# Altium schematic sheet KX1_DB_ADC_2.SchDoc
size A
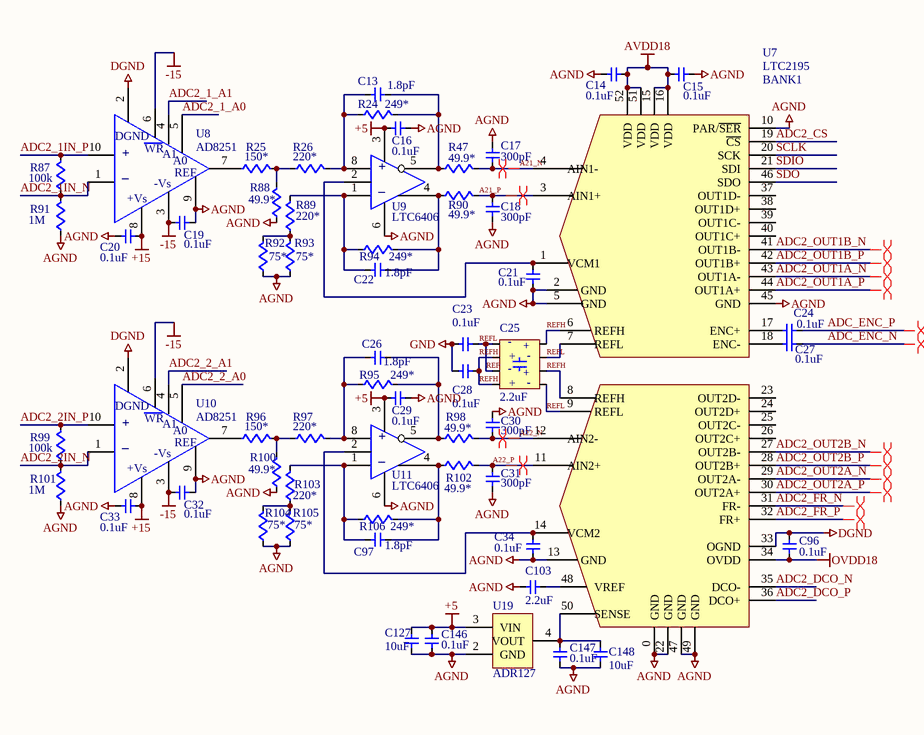
[diagram p0: KX1_DB_ADC_2.SchDoc]

## Parts
C13  1.8pF  [0603w]
C14  0.1uF  [0603w]
C15  0.1uF  [0603w]
C16  0.1uF  [0603w]
C17  300pF  [0603w]
C18  300pF  [0603w]
C19  0.1uF  [0603w]
C20  0.1uF  [0603w]
C21  0.1uF  [0603w]
C22  1.8pF  [0603w]
C23  0.1uF  [0603w]
C24  0.1uF  [1206]
C25  2.2uF  [1206CLL]
C26  1.8pF  [0603w]
C27  0.1uF  [1206]
C28  0.1uF  [0603w]
C29  0.1uF  [0603w]
C30  300pF  [0603w]
C31  300pF  [0603w]
C32  0.1uF  [0603w]
C33  0.1uF  [0603w]
C34  0.1uF  [0603w]
C96  0.1uF  [0603w]
C97  1.8pF  [0603w]
C103  2.2uF  [0603w]
C127  10uF  [0603w]
C146  0.1uF  [0603w]
C147  0.1uF  [0603w]
C148  10uF  [0603w]
R24  249*  [0603w]
R25  150*  [0603w]
R26  220*  [0603w]
R47  49.9*  [0603w]
R87  100k  [0603w]
R88  49.9*  [0603w]
R89  220*  [0603w]
R90  49.9*  [0603w]
R91  1M  [0603w]
R92  75*  [0603w]
R93  75*  [0603w]
R94  249*  [0603w]
R95  249*  [0603w]
R96  150*  [0603w]
R97  220*  [0603w]
R98  49.9*  [0603w]
R99  100k  [0603w]
R100  49.9*  [0603w]
R101  1M  [0603w]
R102  49.9*  [0603w]
R103  220*  [0603w]
R104  75*  [0603w]
R105  75*  [0603w]
R106  249*  [0603w]
U7  LTC2195  [UKG - QFN52]
U8  AD8251  [MSOP10sm]
U9  LTC6406  [MSOP08]
U10  AD8251  [MSOP10sm]
U11  LTC6406  [MSOP08]
U19  ADR127  [TSOT-6]

## Nets
+5: C16.1 C29.1 C127.1 C146.2 U9.3 U11.3 U19.3(VIN)
+15: C20.1 C33.1 U8.8 U10.8
-15: C19.1 C32.1 U8.3 U8.6 U10.3 U10.6
AGND: C14.2 C15.2 C16.2 C17.1 C18.2 C19.2 C20.2 C21.2 C29.2 C30.1 C31.2 C32.2 C33.2 C34.2 C103.2 C127.2 C146.1 C147.1 C148.2 R88.1 R91.1 R92.1 R93.1 R100.1 R101.1 R104.1 R105.1 U7.0(GND) U7.2(GND) U7.5(GND) U7.10(PAR/~{SER}) U7.13(GND) U7.22(GND) U7.45(GND) U7.47(GND) U7.49(GND) U8.9 U9.6 U10.9 U11.6 U19.2(GND)
AVDD18: C14.1 C15.1 U7.15(VDD) U7.16(VDD) U7.51(VDD) U7.52(VDD)
DGND: C96.1 U7.33(OGND) U8.2 U10.2
GND: C23.2 C28.2
OVDD18: C96.2 U7.34(OVDD)
A21_N: C17.2 R47.2 U7.4(AIN1-)
A21_P: C18.1 R90.2 U7.3(AIN1+)
A22_N: C30.2 R98.2 U7.12(AIN2-)
A22_P: C31.1 R102.2 U7.11(AIN2+)
ADC2_1_A0: U8.5
ADC2_1_A1: U8.4
ADC2_1IN_N: R87.1 R91.2 U8.1
ADC2_1IN_P: R87.2 U8.10
ADC2_2_A0: U10.5
ADC2_2_A1: U10.4
ADC2_2IN_N: R99.1 R101.2 U10.1
ADC2_2IN_P: R99.2 U10.10
ADC2_CS: U7.19(~{CS})
ADC2_DCO_N: U7.35(DCO-)
ADC2_DCO_P: U7.36(DCO+)
ADC2_FR_N: U7.31(FR-)
ADC2_FR_P: U7.32(FR+)
ADC2_OUT1A_N: U7.43(OUT1A-)
ADC2_OUT1A_P: U7.44(OUT1A+)
ADC2_OUT1B_N: U7.41(OUT1B-)
ADC2_OUT1B_P: U7.42(OUT1B+)
ADC2_OUT2A_N: U7.29(OUT2A-)
ADC2_OUT2A_P: U7.30(OUT2A+)
ADC2_OUT2B_N: U7.27(OUT2B-)
ADC2_OUT2B_P: U7.28(OUT2B+)
ADC_ENC_N: C27.2
ADC_ENC_P: C24.2
REFH: C25.2 C25.4 C25.6 C25.8 C28.1 U7.6(REFH) U7.8(REFH)
REFL: C23.1 C25.1 C25.3 C25.5 C25.7 U7.7(REFL) U7.9(REFL)
SCLK: U7.20(SCK)
SDIO: U7.21(SDI)
SDO: U7.46(SDO)
NetC13_1: C13.1 R24.1 R26.2 U9.8
NetC13_2: C13.2 R24.2 R47.1 U9.5
NetC21_1: C21.1 U7.1(VCM1) U9.2
NetC22_1: C22.1 R89.2 R94.1 U9.1
NetC22_2: C22.2 R90.1 R94.2 U9.4
NetC24_1: C24.1 U7.17(ENC+)
NetC26_1: C26.1 R95.1 R97.2 U11.8
NetC26_2: C26.2 R95.2 R98.1 U11.5
NetC27_1: C27.1 U7.18(ENC-)
NetC34_1: C34.1 U7.14(VCM2) U11.2
NetC97_1: C97.1 R103.2 R106.1 U11.1
NetC97_2: C97.2 R102.1 R106.2 U11.4
NetC103_1: C103.1 U7.48(VREF)
NetC147_2: C147.2 C148.1 U7.50(SENSE) U19.4(VOUT)
NetR25_1: R25.1 U8.7
NetR25_2: R25.2 R26.1 R88.2
NetR89_1: R89.1 R92.2 R93.2
NetR96_1: R96.1 U10.7
NetR96_2: R96.2 R97.1 R100.2
NetR103_1: R103.1 R104.2 R105.2

Not connected (* = marked no-connect by the designer): U7 23(OUT2D-) 24(OUT2D+) 25(OUT2C-) 26(OUT2C+) 37(OUT1D-) 38(OUT1D+) 39(OUT1C-) 40(OUT1C+); U19 1(NC) 5(NC) 6(NC)

## Layout directives
differential pair: A21_N, A21_P, A22_N, A22_P, ADC2_FR_N, ADC2_FR_P, ADC2_OUT1A_N, ADC2_OUT1A_P, ADC2_OUT1B_N, ADC2_OUT1B_P, ADC2_OUT2A_N, ADC2_OUT2A_P, ADC2_OUT2B_N, ADC2_OUT2B_P, ADC_ENC_N, ADC_ENC_P

## Notes on the sheet
- (near U7) BANK1
- (in symbol AD8139) +; _
- (in symbol AD8251) DGND; WR; +; A1; A0; _; REF; -Vs; +Vs
- (in symbol CAP_SM Interdigitated) +

## Library data of the parts
C13 C17 C18 C22 C26 C30 C31 C97 = CAP_SM_1: capacitor; Supplier 1: Digi-Key
  C13 C22 C26 C97: Supplier Part Number 1: 712-1328-1-ND
  C17 C18 C30 C31: Supplier Part Number 1: 490-1438-1-ND
C14 C15 C19-C21 C23 C28 C29 C32-C34 C96 C146 C147 = CAP_SM_1: capacitor; Manufacturer: Kemet; Manufacturer Part Number: C0603C104K3RACTU; Capacitance: 0.1µF; Temperature Coefficient: X7R; Tolerance: ±10%; Voltage - Rated: 25V; Applications: General Purpose; Category: Capacitors; ComponentLink1Description: http://www.kemet.com/datasheets&C0603C104K3RACTU; ComponentLink1URL: http://www.kemet.com/datasheets&C0603C104K3RACTU; Features: -; Lead Spacing: -; Lead Style: -; Mounting Type: Surface Mount, MLCC; Operating Temperature: -55°C ~ 125°C; Package / Case: 0603 (1608 Metric); Packaging: Cut Tape (CT); Pricing 1: 10=0.075, 100=0.027, 250=0.01952, 500=0.0144, 1000=0.00975 (USD); Ratings: -; RoHS: RoHS Compliant; Size / Dimension: 0.063" L x 0.031" W (1.60mm x 0.80mm); Stock 1: 1185883; Supplier 1: Digi-Key; Supplier Part Number 1: 399-1281-1-ND; Thickness: 0.034" (0.87mm)
C16 = CAP_SM_1: capacitor; Manufacturer: Kemet; Manufacturer Part Number: C0603C104K3RACTU; Capacitance: 0.1µF; Voltage - Rated: 25V; Tolerance: ±10%; Temperature Coefficient: X7R; Supplier 1: Digi-Key; Supplier Part Number 1: 399-1281-1-ND; RoHS: RoHS Compliant; Category: Capacitors; Stock 1: 1185883; Pricing 1: 10=0.075, 100=0.027, 250=0.01952, 500=0.0144, 1000=0.00975 (USD); Mounting Type: Surface Mount, MLCC; Operating Temperature: -55°C ~ 125°C; Applications: General Purpose; Ratings: -; Package / Case: 0603 (1608 Metric); Size / Dimension: 0.063" L x 0.031" W (1.60mm x 0.80mm); Height: -; Thickness: 0.034" (0.87mm); Lead Spacing: -; Features: -; Packaging: Cut Tape (CT); Lead Style: -; ComponentLink1URL: http://www.kemet.com/datasheets&C0603C104K3RACTU; ComponentLink1Description: http://www.kemet.com/datasheets&C0603C104K3RACTU
C24 C27 = CAP_SM_1: capacitor; Manufacturer: Murata Electronics North America; Manufacturer Part Number: GRM31C5C1E104JA01L; Capacitance: 0.1µF; Voltage - Rated: 25V; Tolerance: ±5%; Temperature Coefficient: C0G, NP0; Supplier 1: Digi-Key; Supplier Part Number 1: 490-1767-1-ND; RoHS: RoHS Compliant; Category: Capacitors; Stock 1: 374793; Pricing 1: 1=0.57, 10=0.48, 50=0.3436, 100=0.3007, 250=0.23628, 500=0.2148, 1000=0.17184 (USD); Mounting Type: Surface Mount, MLCC; Operating Temperature: -55°C ~ 125°C; Applications: General Purpose; Ratings: -; Package / Case: 1206 (3216 Metric); Size / Dimension: 0.126" L x 0.063" W (3.20mm x 1.60mm); Height: -; Thickness: 0.071" (1.80mm); Lead Spacing: -; Features: -; Packaging: Cut Tape (CT); Lead Style: -; ComponentLink1URL: http://search.murata.co.jp/Ceramy/image/img/PDF/ENG/GRM31C5C1E104JA01.pdf; ComponentLink1Description: http://search.murata.co.jp/Ceramy/image/img/PDF/ENG/GRM31C5C1E104JA01.pdf
C25 = CAP_SM Interdigitated: INTERDIGITATED capacitor; Manufacturer: TDK Corporation; Manufacturer Part Number: CLLE1AX7S0G225M/0.95; Capacitance: 2.2µF; Voltage - Rated: 4V; Tolerance: ±20%; Temperature Coefficient: X7S; Supplier 1: Digi-Key; Supplier Part Number 1: 445-3406-1-ND; RoHS: RoHS Compliant; Category: Capacitors; Stock 1: 11249; Pricing 1: 1=0.68, 10=0.54, 100=0.325, 250=0.24376, 500=0.208, 1000=0.1625 (USD); Mounting Type: Surface Mount, MLCC; Operating Temperature: -55°C ~ 125°C; Applications: General Purpose; Ratings: -; Package / Case: 0805 (2012 Metric); Size / Dimension: 0.079" L x 0.049" W (2.00mm x 1.25mm); Height: -; Thickness: 0.037" (0.95mm); Lead Spacing: -; Features: Low ESL (Multi-Terminal); Packaging: Cut Tape (CT); Lead Style: -; ComponentLink1URL: http://www.tdk.com/pdf/uli_A11.pdf; ComponentLink1Description: http://www.tdk.com/pdf/uli_A11.pdf
C103 = CAP_SM_1: capacitor; Manufacturer: AVX Corporation; Manufacturer Part Number: 06036C225KAT2A; Capacitance: 2.2µF; Voltage - Rated: 6.3V; Tolerance: ±10%; Temperature Coefficient: X7R; Supplier 1: Digi-Key; Supplier Part Number 1: 478-5316-1-ND; RoHS: RoHS Compliant; Category: Capacitors; Stock 1: 284343; Pricing 1: 10=0.209, 100=0.1235, 500=0.07126, 1000=0.0494 (USD); Mounting Type: Surface Mount, MLCC; Operating Temperature: -55°C ~ 125°C; Applications: General Purpose; Ratings: -; Package / Case: 0603 (1608 Metric); Size / Dimension: 0.063" L x 0.032" W (1.60mm x 0.81mm); Height: -; Thickness: 0.035" (0.90mm); Lead Spacing: -; Features: -; Packaging: Cut Tape (CT); Lead Style: -; ComponentLink1URL: http://www.avx.com/docs/Catalogs/cx7r.pdf; ComponentLink1Description: http://www.avx.com/docs/Catalogs/cx7r.pdf
C127 C148 = CAP_SM_1: capacitor; Manufacturer: Murata Electronics North America; Manufacturer Part Number: GRM188R60J106ME47D; Capacitance: 10µF; Voltage - Rated: 6.3V; Tolerance: ±20%; Temperature Coefficient: X5R; Supplier 1: Digi-Key; Supplier Part Number 1: 490-3896-1-ND; RoHS: RoHS Compliant; Category: Capacitors; Stock 1: 1274844; Pricing 1: 1=0.47, 10=0.369, 50=0.2428, 100=0.1926, 250=0.14236, 500=0.11056, 1000=0.0871 (USD); Mounting Type: Surface Mount, MLCC; Operating Temperature: -55°C ~ 85°C; Applications: General Purpose; Ratings: -; Package / Case: 0603 (1608 Metric); Size / Dimension: 0.063" L x 0.031" W (1.60mm x 0.80mm); Height: -; Thickness: 0.035" (0.90mm); Lead Spacing: -; Features: -; Packaging: Cut Tape (CT); Lead Style: -; ComponentLink1URL: http://search.murata.co.jp/Ceramy/image/img/PDF/ENG/GRM188R60J106ME47.pdf; ComponentLink1Description: http://search.murata.co.jp/Ceramy/image/img/PDF/ENG/GRM188R60J106ME47.pdf
R24-R26 R89 R94-R97 R103 R106 = RES_SM: resistor; Supplier 1: Digi-Key
  R24 R94 R95 R106: Supplier Part Number 1: RNCS0603BKE249RCT-ND
  R25 R96: Supplier Part Number 1: RNCS0603BKE150RCT-ND
  R26 R89 R97 R103: Supplier Part Number 1: RG16P220BCT-ND
R47 R88 R90 R98 R100 R102 = RES_SM: resistor; Manufacturer: Stackpole Electronics Inc; Manufacturer Part Number: RNCS0603BKE49R9; Resistance (Ohms): 49.9; Power (Watts): 0.063W, 1/16W; Temperature Coefficient: ±25ppm/°C; Tolerance: ±0.1%; Supplier 1: Digi-Key; Supplier Part Number 1: RNCS0603BKE49R9CT-ND; RoHS: RoHS Compliant; Category: Resistors; Stock 1: 13782; Pricing 1: 1=0.7, 10=0.475, 50=0.2876, 100=0.2375, 250=0.18752, 500=0.16 (USD); Composition: Thin Film; Features: Anti-Corrosive, Moisture Resistant; Size / Dimension: 0.061" L x 0.031" W (1.55mm x 0.80mm); Height: 0.018" (0.45mm); Number of Terminations: 2; Packaging: Cut Tape (CT); Package / Case: 0603 (1608 Metric); ComponentLink1URL: http://www.seielect.com/Catalog/SEI-rncs.pdf; ComponentLink1Description: http://www.seielect.com/Catalog/SEI-rncs.pdf
R87 R99 = RES_SM: resistor; Manufacturer: Yageo; Manufacturer Part Number: RC0603FR-07100KL; Power (Watts): 0.1W, 1/10W; Temperature Coefficient: ±100ppm/°C; Tolerance: ±1%; Supplier 1: Digi-Key; Supplier Part Number 1: 311-100KHRCT-ND; RoHS: RoHS Compliant; Category: Resistors; Stock 1: 3397757; Pricing 1: 10=0.014, 50=0.0104, 100=0.0079, 250=0.00584, 500=0.00432, 1000=0.00288 (USD); Resistance (Ohms): 100K; Composition: Thick Film; Features: -; Size / Dimension: 0.063" L x 0.031" W (1.60mm x 0.80mm); Height: 0.018" (0.45mm); Number of Terminations: 2; Packaging: Cut Tape (CT); Package / Case: 0603 (1608 Metric); ComponentLink1URL: http://www.yageo.com/documents/recent/PYu-RC0603_51_RoHS_L_4.pdf; ComponentLink1Description: http://www.yageo.com/documents/recent/PYu-RC0603_51_RoHS_L_4.pdf
R91 R101 = RES_SM: resistor; Manufacturer: Yageo; Manufacturer Part Number: RC0603FR-071ML; Power (Watts): 0.1W, 1/10W; Temperature Coefficient: ±100ppm/°C; Tolerance: ±1%; Supplier 1: Digi-Key; Supplier Part Number 1: 311-1.00MHRCT-ND; RoHS: RoHS Compliant; Category: Resistors; Stock 1: 1849601; Pricing 1: 10=0.014, 50=0.0104, 100=0.0079, 250=0.00584, 500=0.00432, 1000=0.00288 (USD); Resistance (Ohms): 1M; Composition: Thick Film; Features: -; Size / Dimension: 0.063" L x 0.031" W (1.60mm x 0.80mm); Height: 0.018" (0.45mm); Number of Terminations: 2; Packaging: Cut Tape (CT); Package / Case: 0603 (1608 Metric); ComponentLink1URL: http://www.yageo.com/documents/recent/PYu-RC0603_51_RoHS_L_4.pdf; ComponentLink1Description: http://www.yageo.com/documents/recent/PYu-RC0603_51_RoHS_L_4.pdf
R92 R93 R104 R105 = RES_SM: resistor; Manufacturer: Stackpole Electronics Inc; Manufacturer Part Number: RNCS0603BKE75R0; Resistance (Ohms): 75; Power (Watts): 0.063W, 1/16W; Temperature Coefficient: ±25ppm/°C; Tolerance: ±0.1%; Supplier 1: Digi-Key; Supplier Part Number 1: RNCS0603BKE75R0CT-ND; RoHS: RoHS Compliant; Category: Resistors; Stock 1: 2583; Pricing 1: 1=0.7, 10=0.475, 50=0.2876, 100=0.2375, 250=0.18752, 500=0.16 (USD); Composition: Thin Film; Features: Anti-Corrosive, Moisture Resistant; Size / Dimension: 0.061" L x 0.031" W (1.55mm x 0.80mm); Height: 0.018" (0.45mm); Number of Terminations: 2; Packaging: Cut Tape (CT); Package / Case: 0603 (1608 Metric); ComponentLink1URL: http://www.seielect.com/Catalog/SEI-rncs.pdf; ComponentLink1Description: http://www.seielect.com/Catalog/SEI-rncs.pdf
U7 = LTC2195: 16 bit, low power, dual ADC; Supplier 1: Digi-Key; Supplier Part Number 1: LTC2195CUKG#PBF-ND
U8 = AD8251: Programmable Gain Instumentation Amp; Supplier 1: Digi-Key; Supplier Part Number 1: AD8251ARMZ-ND
U9 U11 = AD8139: Differential ADC Driver; Supplier 1: Digi-Key; Supplier Part Number 1: LTC6406CMS8E#PBF-ND
U10 = AD8251: IC AMP INST ICMOS LDRIFT 10MSOP; Supplier 1: Digi-Key; Supplier Part Number 1: AD8251ARMZ-ND
U19 = ADR12x: Voltage Reference; Manufacturer: Analog Devices Inc; Manufacturer Part Number: ADR127AUJZ-REEL7; Reference Type: Series, Precision; Voltage - Output: 1.25V; Tolerance: ±0.24%; Temperature Coefficient: 25ppm/°C; Voltage - Input: 2.7 V ~ 18 V; Number of Channels: 1; Current - Quiescent: 95µA; Current - Output: 5mA; Supplier 1: Digi-Key; Supplier Part Number 1: ADR127AUJZ-REEL7CT-ND; RoHS: RoHS Compliant; Category: Integrated Circuits (ICs); Stock 1: 17098; Pricing 1: 1=3.22, 25=2.484, 100=2.254, 250=2.024, 500=1.748 (USD); Current - Cathode: -; Operating Temperature: -40°C ~ 125°C; Mounting Type: Surface Mount; Package / Case: TSOT-23-6, TSOT-6; Supplier Device Package: TSOT-6; Packaging: Cut Tape (CT); ComponentLink1URL: http://www.analog.com/static/imported-files/Data_Sheets/ADR121_125_127.pdf; ComponentLink1Description: http://www.analog.com/static/imported-files/Data_Sheets/ADR121_125_127.pdf